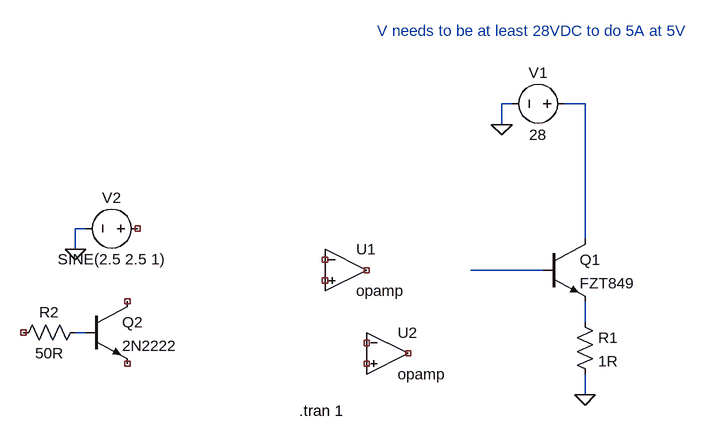
[diagram p0: schematic DarlingtonPairPractice.asc]
DarlingtonPairPractice.asc, the LTspice schematic file:
Version 4
SHEET 1 880 680
WIRE 256 -112 240 -112
WIRE 368 -112 336 -112
WIRE 240 -80 240 -112
WIRE -400 80 -416 80
WIRE 368 96 368 -112
WIRE -416 112 -416 80
WIRE 304 144 192 144
WIRE 368 224 368 192
WIRE -400 240 -416 240
WIRE 368 336 368 304
FLAG 240 -80 0
FLAG 368 336 0
FLAG -416 112 0
SYMBOL npn 304 96 R0
SYMATTR InstName Q1
SYMATTR Value FZT849
SYMBOL npn -400 192 R0
SYMATTR InstName Q2
SYMATTR Value 2N2222
SYMBOL res 352 208 R0
SYMATTR InstName R1
SYMATTR Value 1R
SYMBOL voltage 352 -112 R90
WINDOW 0 -32 56 VBottom 2
WINDOW 3 32 56 VTop 2
WINDOW 123 0 0 Left 0
WINDOW 39 0 0 Left 0
SYMATTR InstName V1
SYMATTR Value 28
SYMBOL voltage -304 80 R90
WINDOW 0 -32 56 VBottom 2
WINDOW 3 32 56 VTop 2
WINDOW 123 0 0 Left 0
WINDOW 39 0 0 Left 0
SYMATTR InstName V2
SYMATTR Value SINE(2.5 2.5 1)
SYMBOL res -512 256 R270
WINDOW 0 32 56 VTop 2
WINDOW 3 0 56 VBottom 2
SYMATTR InstName R2
SYMATTR Value 50R
SYMBOL OpAmps\\opamp 0 80 R0
SYMATTR InstName U1
SYMBOL OpAmps\\opamp 64 208 R0
SYMATTR InstName U2
TEXT -72 360 Left 2 !.tran 1
TEXT 48 -224 Left 2 ;V needs to be at least 28VDC to do 5A at 5V

The netlist it stands for:
* DarlingtonPairPractice.asc
Q1 N001 N002 N003 0 FZT849
Q2 NC_01 N004 NC_02 0 2N2222
R1 N003 0 1R
V1 N001 0 28
V2 NC_03 0 SINE(2.5 2.5 1)
R2 NC_04 N004 50R
XU1 NC_05 NC_06 NC_07 opamp Aol=100K GBW=10Meg  ; pins invin noninvin out
XU2 NC_08 NC_09 NC_10 opamp Aol=100K GBW=10Meg  ; pins invin noninvin out
.model NPN NPN
.model PNP PNP
.lib standard.bjt
.tran 1
* V needs to be at least 28VDC to do 5A at 5V
.backanno
.end